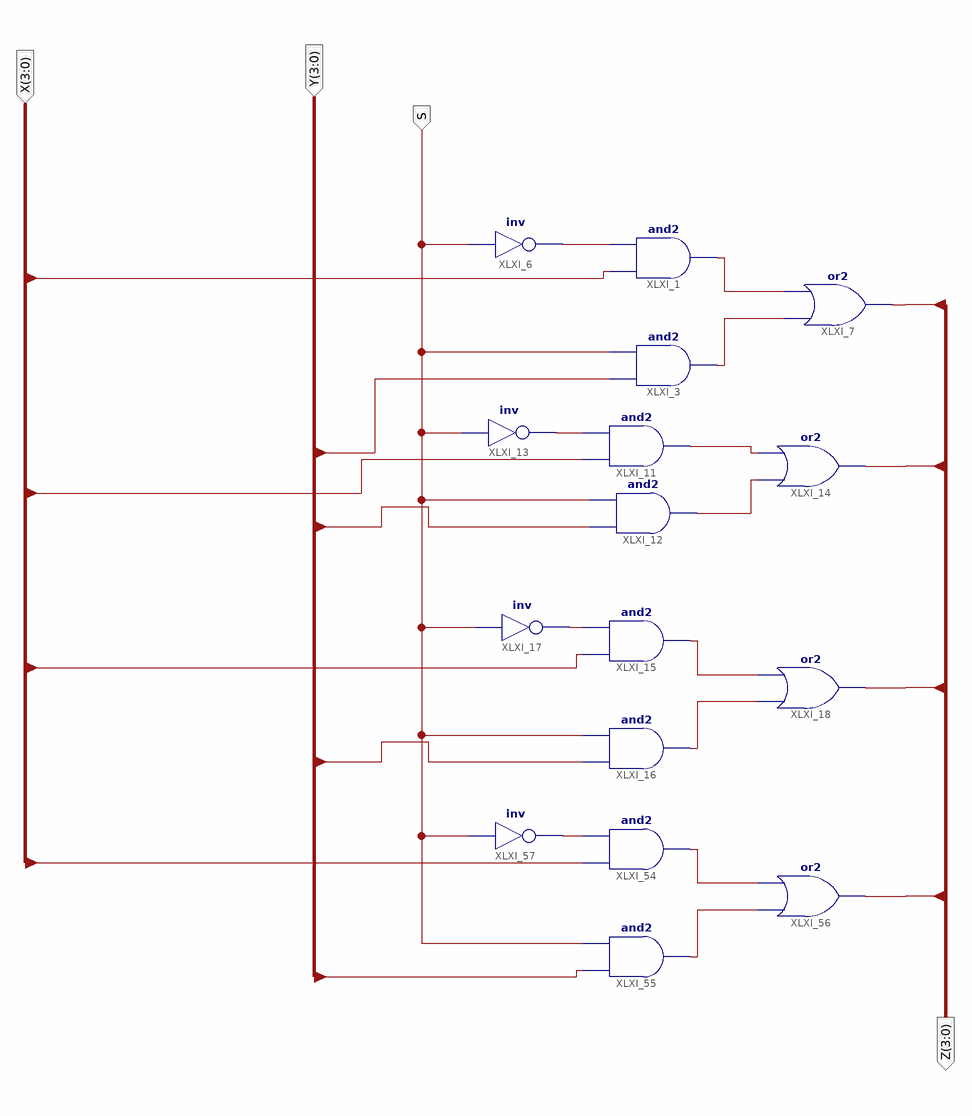
[diagram p0: schematic sheet 1]
// Xilinx ISE schematic mux4_2to1.sch (virtex6) as structural Verilog: 16 symbols, 4 ports
module mux4_2to1 (
  input  S,
  input  [3:0] Y,
  input  [3:0] X,
  output [3:0] Z
);

  wire XLXN_7, XLXN_8, XLXN_9, XLXN_26, XLXN_27, XLXN_29, XLXN_30, XLXN_31, XLXN_33, XLXN_84, XLXN_86,
       XLXN_87;

  and XLXI_15 (XLXN_31, X[2], XLXN_30);
  and XLXI_16 (XLXN_33, Y[2], S);
  or XLXI_18 (Z[2], XLXN_33, XLXN_31);
  or XLXI_14 (Z[1], XLXN_29, XLXN_27);
  and XLXI_11 (XLXN_27, X[1], XLXN_26);
  and XLXI_12 (XLXN_29, Y[1], S);
  not XLXI_13 (XLXN_26, S);
  not XLXI_17 (XLXN_30, S);
  and XLXI_54 (XLXN_84, X[3], XLXN_87);
  and XLXI_55 (XLXN_86, Y[3], S);
  or XLXI_56 (Z[3], XLXN_86, XLXN_84);
  not XLXI_57 (XLXN_87, S);
  not XLXI_6 (XLXN_7, S);
  or XLXI_7 (Z[0], XLXN_9, XLXN_8);
  and XLXI_3 (XLXN_9, Y[0], S);
  and XLXI_1 (XLXN_8, X[0], XLXN_7);
endmodule
